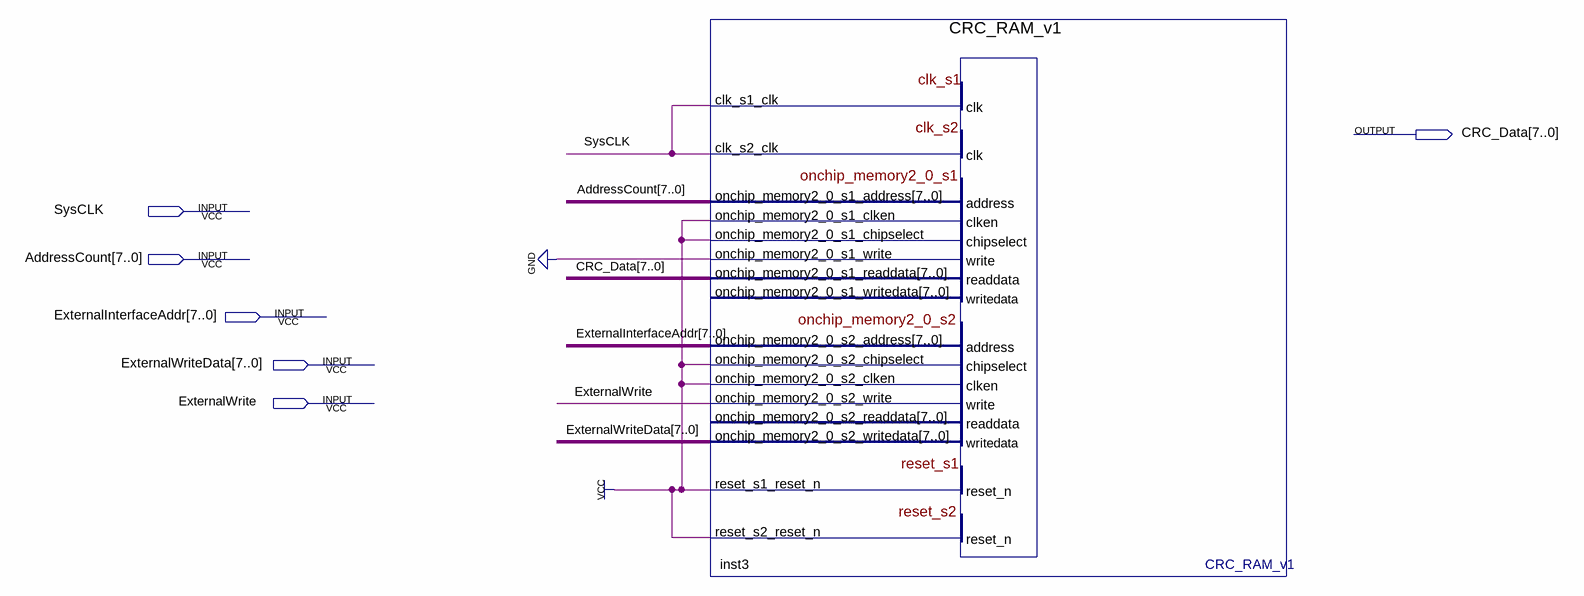
[diagram p0: schematic sheet]
// Quartus schematic CRC_RAM_Wrapper.bdf as structural Verilog: 1 symbols, 6 pins
module CRC_RAM_Wrapper (
  input  SysCLK,
  input  [7:0] AddressCount,
  input  [7:0] ExternalInterfaceAddr,
  input  [7:0] ExternalWriteData,
  input  ExternalWrite,
  output [7:0] CRC_Data
);

  CRC_RAM_v1 inst3 (
    .clk_s1_clk(SysCLK), .clk_s2_clk(SysCLK), .onchip_memory2_0_s1_address(AddressCount),
    .onchip_memory2_0_s1_clken(1'b1), .onchip_memory2_0_s1_chipselect(1'b1),
    .onchip_memory2_0_s1_write(1'b0), .onchip_memory2_0_s2_address(ExternalInterfaceAddr),
    .onchip_memory2_0_s2_chipselect(1'b1), .onchip_memory2_0_s2_clken(1'b1),
    .onchip_memory2_0_s2_write(ExternalWrite), .onchip_memory2_0_s2_writedata(ExternalWriteData),
    .reset_s1_reset_n(1'b1), .reset_s2_reset_n(1'b1), .onchip_memory2_0_s1_readdata(CRC_Data));  // open: onchip_memory2_0_s1_writedata, onchip_memory2_0_s2_readdata
endmodule
